# Altium project Sense2goL_V1.2.PrjPcb
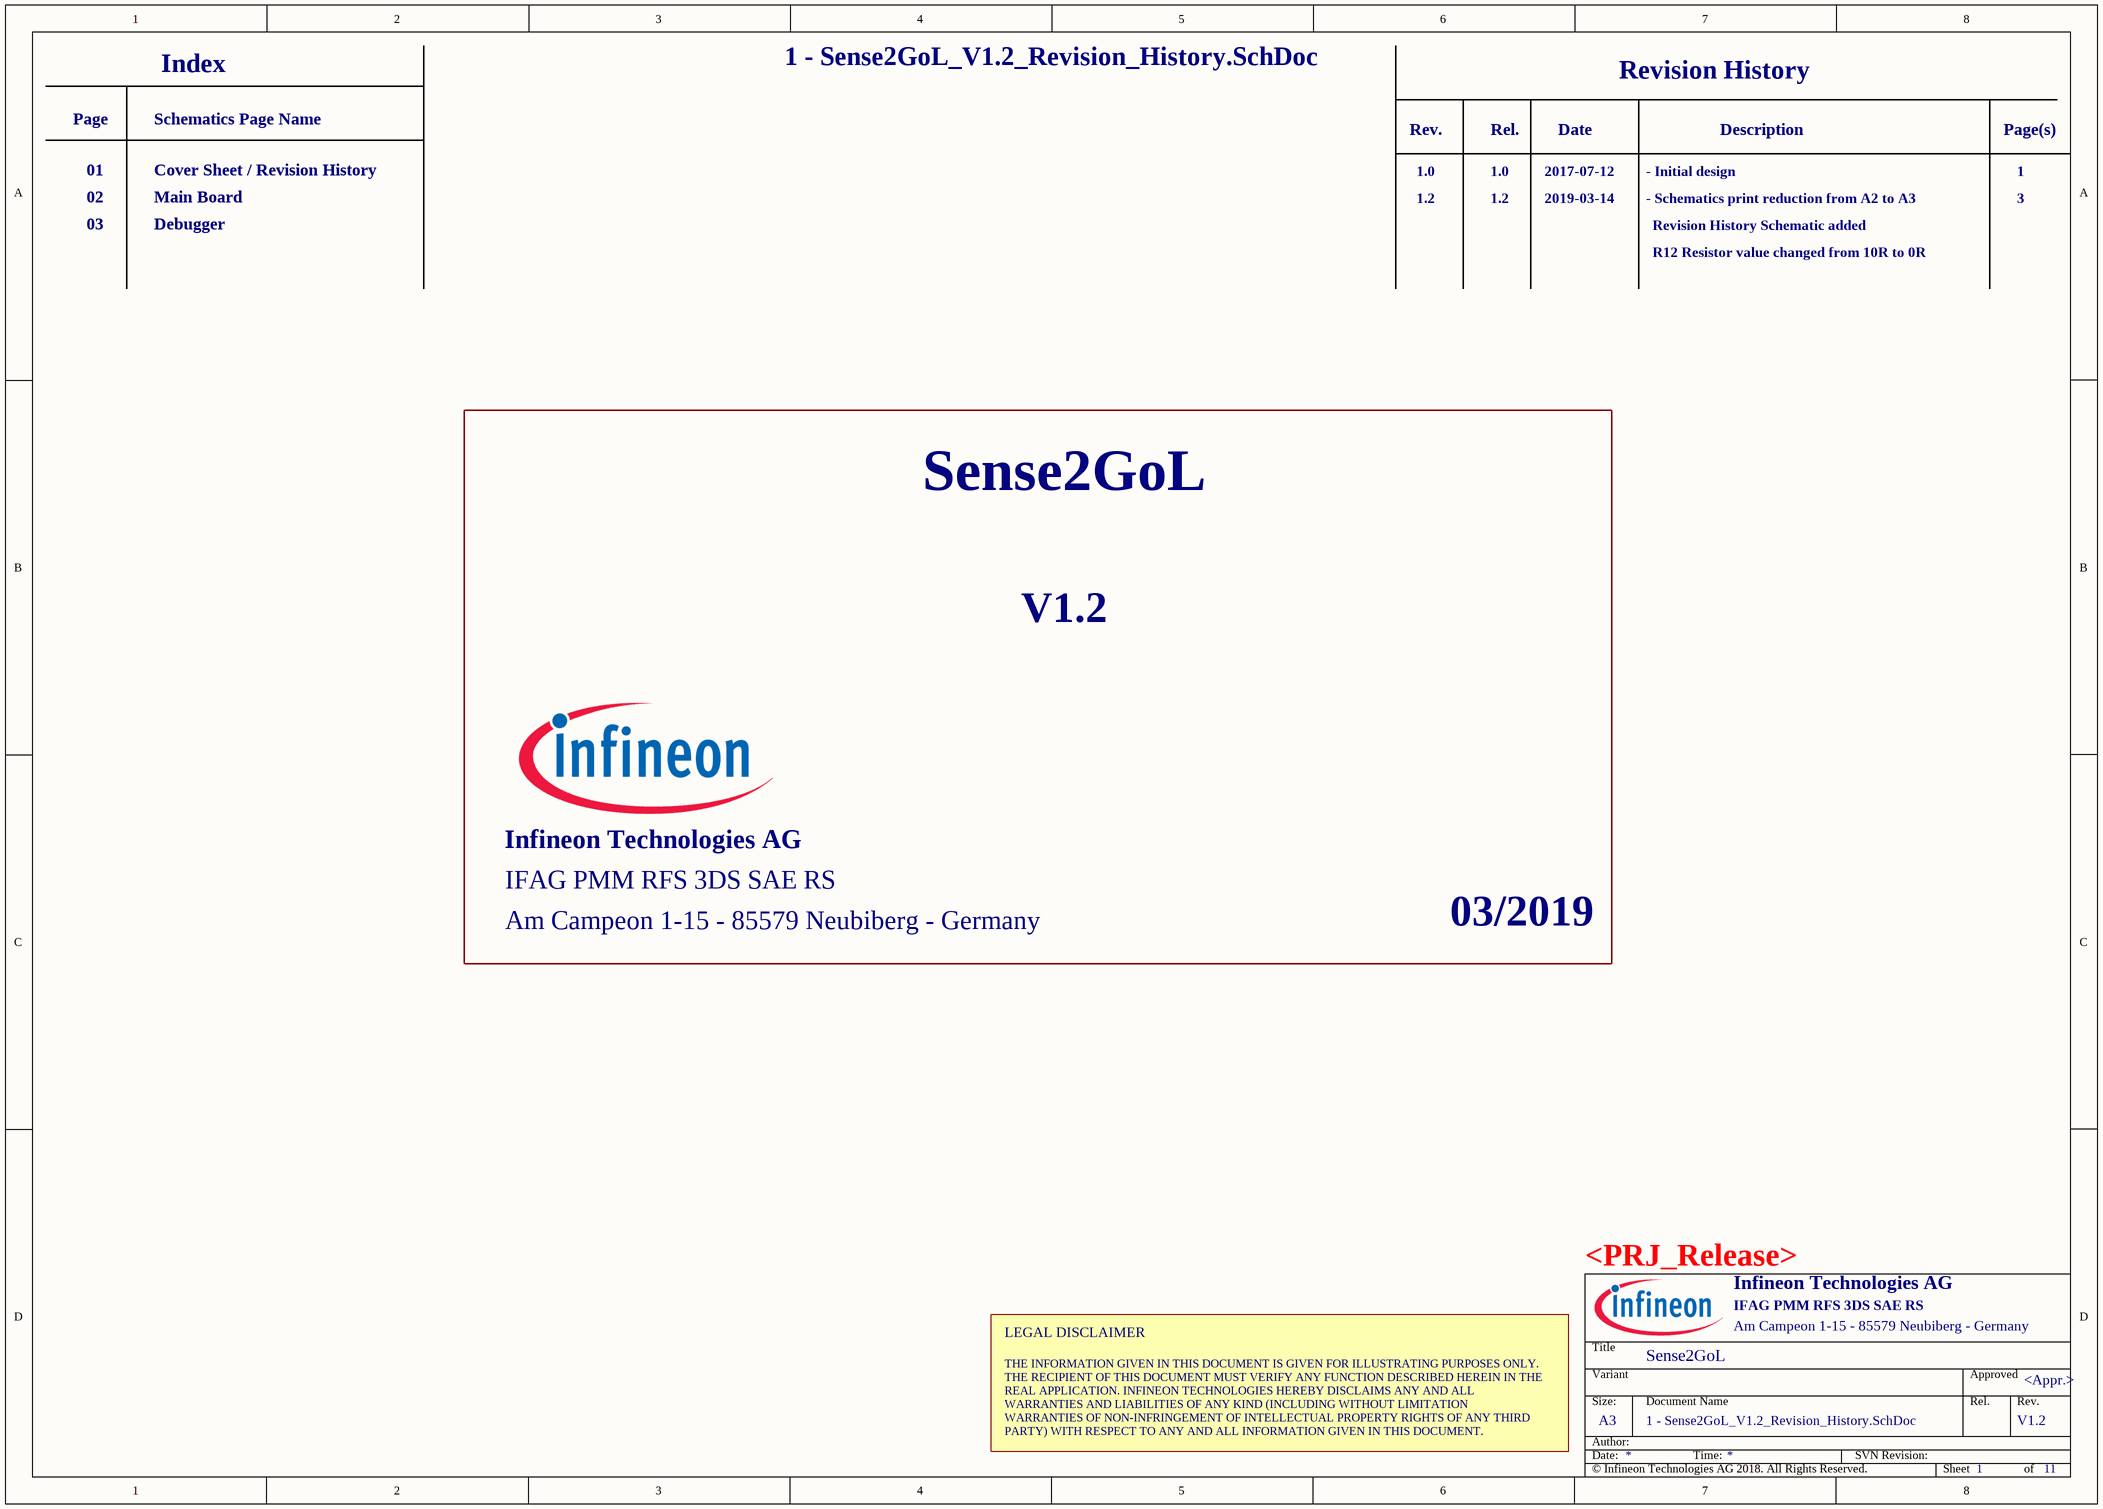
[diagram p0: 1 - Sense2GoL_V1.2_Revision_History.SchDoc]
PRJ_Address1: IFAG PMM RFS 3DS SAE RS; PRJ_Address2: Am Campeon 1-15 - 85579 Neubiberg - Germany; PRJ_ConfidentialStatus: <PRJ_Release>; PRJ_Copyright: © Infineon Technologies AG 2018. All Rights Reserved.; PRJ_Organization: Infineon Technologies AG; PRJ_Revision: V1.2; PRJ_SCH_Revision: V1.2; PRJ_Title: Sense2GoL; PRJ_Year: 03/2019
3 sheets, 114 parts. Net scope: global (net labels, ports and power ports of the same name join across sheets).
Board file: Sense2goL_V1.2.PcbDoc
Sheets:
  1 - Sense2GoL_V1.2_Revision_History.SchDoc
  2 - Sense2GoL_V1.2_Main_Board.SchDoc
  3 - Sense2GoL_V1.2_Debugger.SchDoc

## Sheet 1 - Sense2GoL_V1.2_Revision_History.SchDoc: <Project Name>
size A3; ApprovedBy: <Appr.>; Author: <Author>; CompanyName: Infineon Technologies AG; Engineer: <Rel.>; Organization: Infineon Technologies AG; Address1: IFAG PMM RFS MM AE; Address2: Am Campeon 1-12  -  85579 Neubiberg  -  Germany; Address3: 85579 Neubiberg; Address4: Germany; DocumentNumber: 1; Revision: <Rev.>; SheetNumber: 1; SheetTotal: 11; Release: RC00; PageSetup: Record=PageOptions|CenterHorizontal=True|CenterVertical=True|PrintScale=1.01|XCorrection=1.00|YCorrection=1.00|PrintKind=0|BorderSize=5000000|LeftOffset=0|BottomOffset=0|Orientation=2|PaperLength=1000|PaperWidth=1000|Scale=100|PaperSource=7|PrintQuality=-4|MediaType=1|DitherType=10|PaperKind=A3|PrintScaleMode=1; Doc_ConfidentialStatus: <Confidential>; Doc_Preliminary: <Doc_Preliminary>

### Notes on the sheet
- Index
- Revision History
- Page
- 01
- Cover Sheet / Revision History
- Schematics Page Name
- Rev.
- 1.0
- Rel.
- 2017-07-12
- Date
- - Initial design
- Description
- Page(s)
- 1
- 03
- 02
- Debugger
- Main Board
- 1.2
- 2019-03-14
- - Schematics print reduction from A2 to A3
- Revision History Schematic added
- 3
- R12 Resistor value changed from 10R to 0R
- LEGAL DISCLAIMER
- THE INFORMATION GIVEN IN THIS DOCUMENT IS GIVEN FOR ILLUSTRATING PURPOSES ONLY.
  THE RECIPIENT OF THIS DOCUMENT MUST VERIFY ANY FUNCTION DESCRIBED HEREIN IN THE
  REAL APPLICATION. INFINEON TECHNOLOGIES HEREBY DISCLAIMS ANY AND ALL
  WARRANTIES AND LIABILITIES OF ANY KIND (INCLUDING WITHOUT LIMITATION
  WARRANTIES OF NON-INFRINGEMENT OF INTELLECTUAL PROPERTY RIGHTS OF ANY THIRD
  PARTY) WITH RESPECT TO ANY AND ALL INFORMATION GIVEN IN THIS DOCUMENT.
- Title
- Variant
- Approved
- Date:
- Author:
- Size:
- A3
- Document Name
- Time:
- SVN Revision:
- Sheet
- of

## Sheet 2 - Sense2GoL_V1.2_Main_Board.SchDoc
size A3; Doc_ConfidentialStatus: <Doc_ConfidentialStatus>; Doc_Preliminary: <Doc_Preliminary>; Release: <Rel.>; Copyright: © Infineon Technologies AG 2014. All Rights Reserved.; DVS_Title: <DVS_Title>; DVS_Author: <DVS_Author>; DVS_ApprovedBy: <DVS_Appr>; DVS_Revision: <DVS_Rev.>; DVS_Release: <DVS_Rel.>; DVS_Configuration: <DVS_Configuration>; PageSetup: Record=PageOptions|CenterHorizontal=True|CenterVertical=True|PrintScale=1.01|XCorrection=1.00|YCorrection=1.00|PrintKind=0|BorderSize=5000000|LeftOffset=0|BottomOffset=0|Orientation=2|PaperLength=1000|PaperWidth=1000|Scale=100|PaperSource=7|PrintQuality=-4|MediaType=1|DitherType=10|PaperKind=A3|PrintScaleMode=1
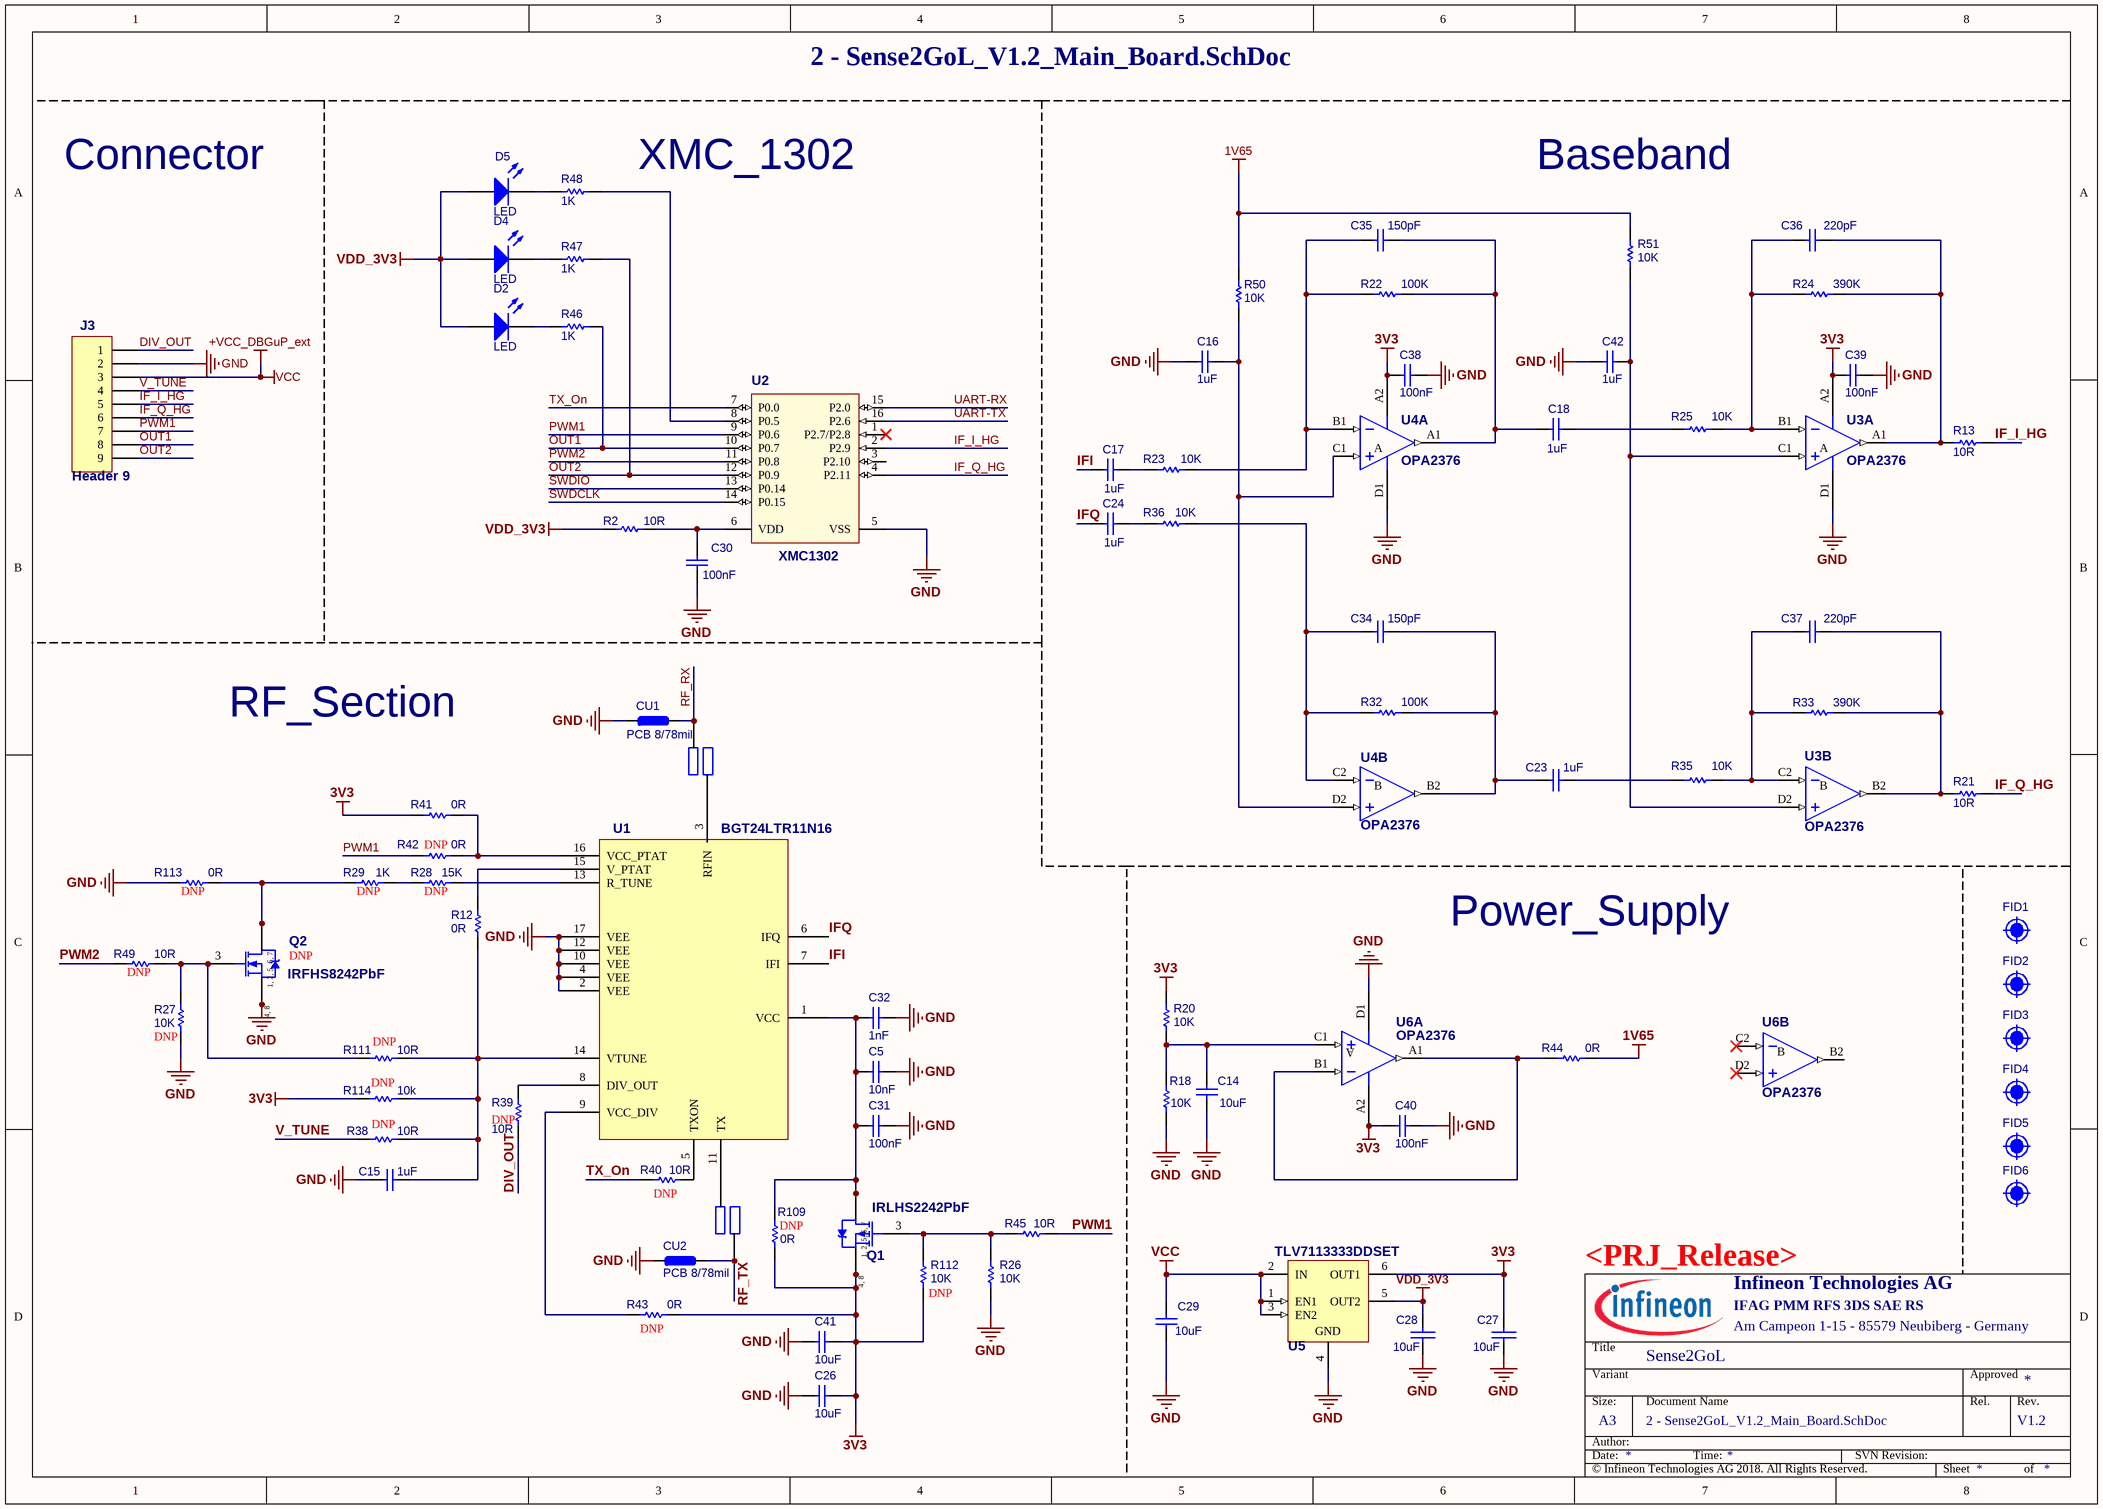
[diagram p1: 2 - Sense2GoL_V1.2_Main_Board.SchDoc]

### Parts
C5  value 10nF  [C_0201]  (hidden comment: Cap)
C14  value 10uF  [0402_DURAC]  (hidden comment: Cap)
C15  value 1uF  [0402_DURAC]  (hidden comment: Cap)
C16  value 1uF  [0402_DURAC]  (hidden comment: Cap)
C17  value 1uF  [0402_DURAC]  (hidden comment: 1µF)
C18  value 1uF  [0402_DURAC]  (hidden comment: Cap)
C23  value 1uF  [0402_DURAC]  (hidden comment: Cap)
C24  value 1uF  [0402_DURAC]  (hidden comment: Cap)
C26  value 10uF  [0402_DURAC]  (hidden comment: Cap)
C27  value 10uF  [0402_DURAC]  (hidden comment: CAP-10uF-10V-20%-0603)
C28  value 10uF  [0402_DURAC]  (hidden comment: CAP-10uF-10V-20%-0603)
C29  value 10uF  [0402_DURAC]  (hidden comment: CAP-1uF-25V-10%-0402)
C30  value 100nF  [C_0201]  (hidden comment: Cap)
C31  value 100nF  [C_0201]  (hidden comment: Cap)
C32  value 1nF  [C_0201]  (hidden comment: Cap)
C34  value 150pF  [C_0201]  (hidden comment: Cap)
C35  value 150pF  [C_0201]  (hidden comment: Cap)
C36  value 220pF  [C_0201]  (hidden comment: Cap)
C37  value 220pF  [C_0201]  (hidden comment: Cap)
C38  value 100nF  [C_0201]  (hidden comment: Cap)
C39  value 100nF  [C_0201]  (hidden comment: Cap)
C40  value 100nF  [C_0201]  (hidden comment: Cap)
C41  value 10uF  [0402_DURAC]  (hidden comment: Cap)
C42  value 1uF  [0402_DURAC]  (hidden comment: Cap)
CU1  PCB 8/78mil  [24GHZ_TRACE_8_78]  (net tie, no BOM)
CU2  PCB 8/78mil  [24GHZ_TRACE_8_78]  (net tie, no BOM)
D2  LED  [LED_0201]
D4  LED  [LED_0201]
D5  LED  [LED_0201]
DC1  HF-Bandbpass  [DC_BLOCK_24GHZ]  (value not drawn)  (no BOM)
DC2  HF-Bandbpass  [DC_BLOCK_24GHZ]  (value not drawn)  (no BOM)
FID1  Fiducial  [FID_1.1mm]  (value not drawn)
FID2  Fiducial  [FID_1.1mm]  (value not drawn)
FID3  Fiducial  [FID_1.1mm]  (value not drawn)
FID4  Fiducial  [FID_1.1mm]  (value not drawn)
FID5  Fiducial  [FID_1.1mm]  (value not drawn)
FID6  Fiducial  [FID_1.1mm]  (value not drawn)
J3  Header 9  [CONN_9_90DEG_TH]
Q1  IRLHS2242PbF  [IRLSH2242]
Q2  value IRFHS8242PbF  [IRLSH2242]  (hidden comment: DNP)
R2  value 10R  [R_0201]  (hidden comment: Res1)
R12  value 0R  [R_0201]  (hidden comment: Res1)
R13  value 10R  [R_0201]  (hidden comment: Res1)
R18  value 10K  [R_0201]  (hidden comment: Res1)
R20  value 10K  [R_0201]  (hidden comment: Res1)
R21  value 10R  [R_0201]  (hidden comment: Res1)
R22  value 100K  [R_0201]  (hidden comment: Res1)
R23  value 10K  [R_0201]  (hidden comment: Res1)
R24  value 390K  [R_0201]  (hidden comment: Res1)
R25  value 10K  [R_0201]  (hidden comment: Res1)
R26  value 10K  [R_0201]  (hidden comment: Res1)
R27  value 10K  [R_0201]  (hidden comment: DNP)
R28  value 15K  [R_0201]  (hidden comment: DNP)
R29  value 1K  [R_0201]  (hidden comment: DNP)
R32  value 100K  [R_0201]  (hidden comment: Res1)
R33  value 390K  [R_0201]  (hidden comment: Res1)
R35  value 10K  [R_0201]  (hidden comment: Res1)
R36  value 10K  [R_0201]  (hidden comment: Res1)
R38  value 10R  [R_0201]  (hidden comment: DNP)
R39  value 10R  [R_0201]  (hidden comment: DNP)
R40  value 10R  [R_0201]  (hidden comment: DNP)
R41  value 0R  [R_0201]  (hidden comment: Res1)
R42  value 0R  [R_0201]  (hidden comment: DNP)
R43  value 0R  [R_0201]  (hidden comment: DNP)
R44  value 0R  [R_0201]  (hidden comment: Res1)
R45  value 10R  [R_0201]  (hidden comment: Res1)
R46  value 1K  [R_0201]  (hidden comment: Res1)
R47  value 1K  [R_0201]  (hidden comment: Res1)
R48  value 1K  [R_0201]  (hidden comment: Res1)
R49  value 10R  [R_0201]  (hidden comment: DNP)
R50  value 10K  [R_0201]  (hidden comment: Res1)
R51  value 10K  [R_0201]  (hidden comment: Res1)
R109  value 0R  [R_0201]  (hidden comment: DNP)
R111  value 10R  [R_0201]  (hidden comment: DNP)
R112  value 10K  [R_0201]  (hidden comment: DNP)
R113  value 0R  [R_0201]  (hidden comment: DNP)
R114  value 10k  [R_0201]  (hidden comment: DNP)
U1  BGT24LTR11N16  [TSNP-16-9]
U2  XMC1302  [inf-pg-tssop-16-8_n]
U3  OPA2376  [OPA2376_DSBGA]  (parts A,B of 2)
U4  OPA2376  [OPA2376_DSBGA]  (parts A,B of 2)
U5  TLV7113333DDSET  [TLV7113333]
U6  OPA2376  [OPA2376_DSBGA]  (parts A,B of 2)

### Nets
1V65: R44.2 R50.1 R51.1
3V3: C26.2 C27.1 C38.1 C39.1 C40.1 C41.2 Q1.4(S) Q1.8(S) R20.2 R41.1 R43.2 R109.1 R112.1 R114.1 U3.A2(V+) U4.A2(V+) U5.6(OUT1) U6.A2(V+)
+VCC_DBGuP_ext: C29.1 J3.3 U5.1(EN1) U5.2(IN) U5.3(EN2)  [also labelled VCC]
GND: C5.2 C14.2 C15.1 C16.1 C26.1 C27.2 C28.2 C29.2 C30.2 C31.2 C32.2 C38.2 C39.2 C40.2 C41.1 C42.1 CU1.2 CU2.2 J3.2 Q2.4(S) Q2.8(S) R18.1 R26.1 R27.1 R113.1 U1.2(VEE) U1.4(VEE) U1.10(VEE) U1.12(VEE) U1.17(VEE) U2.5(VSS) U3.D1(V-) U4.D1(V-) U5.4(GND) U6.D1(V-)
VDD_3V3: C28.1 D2.1(A) D4.1(A) D5.1(A) R2.1 U5.5(OUT2)
DIV_OUT: J3.1 R39.1
IF_I_HG: J3.5 R13.2 U2.2(P2.9)
IF_Q_HG: J3.6 R21.2 U2.4(P2.11)
IFI: C17.1 U1.7(IFI)
IFQ: C24.1 U1.6(IFQ)
OUT1: J3.8 R46.2 U2.10(P0.7)
OUT2: J3.9 R47.2 U2.12(P0.9)
PWM1: J3.7 R42.1 R45.2 U2.9(P0.6)
PWM2: R49.1 U2.11(P0.8)
RF_RX: CU1.1 DC2.1
RF_TX: CU2.1 DC1.1
SWDCLK: U2.14(P0.15)
SWDIO: U2.13(P0.14)
TX_On: R40.1 U2.7(P0.0)
UART-RX: U2.15(P2.0)
UART-TX: U2.16(P2.6)
V_TUNE: J3.4 R38.1
NetC5_1: C5.1 C31.1 C32.1 Q1.1(D) Q1.2(D) Q1.5(D) Q1.6(D) Q1.7(D) R109.2 U1.1(VCC)
NetC14_1: C14.1 R18.2 R20.1 U6.C1(+INA)
NetC15_2: C15.2 R12.1 R38.2 R111.2 R114.2 U1.14(VTUNE)
NetC16_2: C16.2 R50.2 U4.C1(+INA) U4.D2(IN+)
NetC17_2: C17.2 R23.1
NetC18_1: C18.1 C35.2 R22.2 U4.A1(OUT_A)
NetC18_2: C18.2 R25.1
NetC23_1: C23.1 C34.2 R32.2 U4.B2(OUT)
NetC23_2: C23.2 R35.1
NetC24_2: C24.2 R36.1
NetC30_1: C30.1 R2.2 U2.6(VDD)
NetC34_1: C34.1 R32.1 R36.2 U4.C2(IN-)
NetC35_1: C35.1 R22.1 R23.2 U4.B1(-INA)
NetC36_1: C36.1 R24.1 R25.2 U3.B1(-INA)
NetC36_2: C36.2 R13.1 R24.2 U3.A1(OUT_A)
NetC37_1: C37.1 R33.1 R35.2 U3.C2(IN-)
NetC37_2: C37.2 R21.1 R33.2 U3.B2(OUT)
NetC42_2: C42.2 R51.2 U3.C1(+INA) U3.D2(IN+)
NetD2_2: D2.2(K) R46.1
NetD4_2: D4.2(K) R47.1
NetD5_2: D5.2(K) R48.1
NetDC1_2: DC1.2 U1.11(TX)
NetDC2_2: DC2.2 U1.3(RFIN)
NetQ1_3: Q1.3(G) R26.2 R45.1 R112.2
NetQ2_1: Q2.1(D) Q2.2(D) Q2.5(D) Q2.6(D) Q2.7(D) R29.1 R113.2
NetQ2_3: Q2.3(G) R27.2 R49.2 R111.1
NetR12_2: R12.2 U1.15(V_PTAT)
NetR28_1: R28.1 R29.2
NetR28_2: R28.2 U1.13(R_TUNE)
NetR39_2: R39.2 U1.8(DIV_OUT)
NetR40_2: R40.2 U1.5(TXON)
NetR41_2: R41.2 R42.2 U1.16(VCC_PTAT)
NetR43_1: R43.1 U1.9(VCC_DIV)
NetR44_1: R44.1 U6.A1(OUT_A) U6.B1(-INA)
NetR48_2: R48.2 U2.8(P0.5)

Not connected (* = marked no-connect by the designer): U2 1(P2.7/P2.8)* 3(P2.10); U6 B2(OUT) C2(IN-)* D2(IN+)*

### Notes on the sheet
- Connector
- (near R48) XMC_1302
- Baseband
- RF_Section
- (near R42) DNP
- (near R113) DNP
- (near R29) DNP
- (near R28) DNP
- (near R49) DNP
- (near Q2) DNP
- Power_Supply
- (near R27) DNP
- (near R111) DNP
- DNP
- (near R38) DNP
- (near R39) DNP
- (near R40) DNP
- (near R109) DNP
- (near R43) DNP
- (near R112) DNP
- Title
- Variant
- Approved
- Date:
- Author:
- Size:
- A3
- Document Name
- Time:
- SVN Revision:
- Rel.
- Rev.
- Sheet
- of
- (in symbol IRLHS2242PbF) 1, 2, 5, 6, 7; 4, 8
- (in symbol IRLHS8242PbF) 1, 2, 5, 6, 7; 4, 8
- (in symbol OPA2376, part A) A
- (in symbol OPA2376, part B) B

### Library data of the parts
C5 C14-C18 C23 C24 C26 C30-C32 C34-C42 = Cap: Capacitor; Published: 8-Jun-2000; LatestRevisionDate: 17-Jul-2002; LatestRevisionNote: Re-released for DXP Platform.; PackageReference: RAD-0.3; Publisher: Altium Limited
  C17 C18 C23 C24 C34-C37: PackageDescription: Radial Cap, Thru-Hole; 2 Leads; 0.3 in Pin Spacing
C27 C28 = CAP: Ceramic Capacitor X5R/X7R >= 10V; Manufacturer: TDK; Bestellnummer: 2309028; Dielectric: X5R; Footprint: 0603; Link: http://de.farnell.com/tdk/c1608x5r1a106m080ac/kondensator-mlcc-x5r-10uf-10v/dp/2309028; Price: 0.44
C29 = Cap: Capacitor; Manufacturer: TDK; Bestellnummer: 2346884RL; Dielectric: X5R; Link: http://de.farnell.com/tdk/c1005x5r1e105k050bc/kondensator-mlcc-x5r-1uf-25v-0402/dp/2346884RL?ost=2346884RL; Footprint: 0402; Price: 0.07
CU1 CU2 = 24G_Trace: Preis: 0.0; FootprintBOM: -
D2 D4 D5 = LED: Typical INFRARED GaAs LED; Published: 8-Jun-2000; LatestRevisionDate: 08-Jul-2005; LatestRevisionNote: Mech Layer 1 removed.; PackageReference: LED-0; Publisher: Altium Limited
DC1 DC2 = HF-Bandbpass: Preis: 0.00; FootprintBOM: -
FID1-FID6 = FID: FootprintBOM: Fiducal 1.1mm; Notes: Fiducial
J3 = Header 9: Header, 9-Pin; LatestRevisionDate: 17-Jul-2002; LatestRevisionNote: Re-released for DXP Platform.; Publisher: Altium Limited
Q1 = IRLHS2242PbF: Note: Pin 2 is electrically connected to pin 4.; Published: 8-Jun-2000; LatestRevisionDate: 17-Jul-2002; LatestRevisionNote: Re-released for DXP Platform.; DatasheetVersion: May-1998; PackageReference: TO-251AA; Publisher: Altium Limited; PackageDescription: TO, Thru-Hole, Vertical, Heatsink Mounted; 3 In-Line Leads; Pitch 2.28 mm; ComponentLink1Description: Manufacturer Link; ComponentLink1URL: http://www.irf.com/; ComponentLink2Description: Datasheet; ComponentLink2URL: http://www.irf.com/product-info/datasheets/data/irlr120n.pdf
Q2 = IRLHS8242PbF: IRFHS8242PbF; Note: Pin 2 is electrically connected to pin 4.; Published: 8-Jun-2000; LatestRevisionDate: 17-Jul-2002; LatestRevisionNote: Re-released for DXP Platform.; DatasheetVersion: May-1998; PackageReference: TO-251AA; Publisher: Altium Limited; PackageDescription: TO, Thru-Hole, Vertical, Heatsink Mounted; 3 In-Line Leads; Pitch 2.28 mm; ComponentLink1Description: Manufacturer Link; ComponentLink1URL: http://www.irf.com/; ComponentLink2Description: Datasheet; ComponentLink2URL: http://www.irf.com/product-info/datasheets/data/irlr120n.pdf
R2 R12 R13 R18 R20-R29 R32 R33 R35 R36 R38-R51 R109 R111-R114 = Res1: Resistor; Published: 8-Jun-2000; LatestRevisionDate: 17-Jul-2002; LatestRevisionNote: Re-released for DXP Platform.; PackageReference: AXIAL-0.3; Publisher: Altium Limited
  R22-R25 R32 R33 R35 R36: PackageDescription: Axial Device, Thru-Hole; 2 Leads; 0.3 in Pin Spacing
U2 = XMC1302-T016F-0016 AA: code_DK: XMC1302T016X0032ABXUMA1CT-ND
U5 = TLV7113333DDSET: Dual Output High PSRR LDO, 200 mA, Fixed 3.3 V Output, 2 to 5.5 V Input, 6-pin WSON (DSE), -40 to 125 degC, Green (RoHS & no Sb/Br); Manufacturer: Texas Instruments; Fixed Output Options(V): 3.3; Iout(Max)(A): 0.2; Iq(Typ)(mA): 0.03; SubFamily: Dual Channel LDO; Vdo(Typ)(mV): 150; Vin(Max)(V): 5.5; Vin(Min)(V): 2; DatasheetVersion: SBVS142A; PackageVersion: 4207810/A; PackageReference: DSE6; PackageDescription: 6-Pin Plastic Small Outline, Body 1.5 x 1.5 mm, Pitch 0.5 mm; Supplier 1: Digi-Key; Supplier Part Number 1: 296-28766-2-ND; Supplier 2: Digi-Key; Supplier Part Number 2: 296-28766-1-ND; Supplier 3: Digi-Key; Supplier Part Number 3: 296-28766-6-ND; Supplier 4: Mouser; Supplier Part Number 4: 595-TLV7113333DDSET; Eco-Plan: Green (RoHS & no Sb/Br); Mounting Technology: Surface Mount; PartNumber: TLV7113333DDSET; ComponentLink1Description: Manufacturer URL; ComponentLink1URL: http://www.ti.com/; ComponentLink2Description: Datasheet; ComponentLink2URL: http://www.ti.com/general/docs/lit/getliterature.tsp?genericPartNumber=TLV7113333D&fileType=pdf; ComponentLink3Description: Package Specification; ComponentLink3URL: http://www.ti.com/litv/pdf/mpds287
U3 U4 U6 = OPA2376: Published: 8-Jun-2000; LatestRevisionDate: 17-Jul-2002; LatestRevisionNote: Re-released for DXP Platform.; DatasheetVersion: 1996~1997; PackageVersion: revC; PackageReference: ZZ030; Publisher: Altium Limited; PackageDescription: Oval Flange Mount; 8 Leads; Pin Circle Dia. 12.7 mm; Lead Dia. 1.07 mm (max); ComponentLink1Description: Manufacturer Link; ComponentLink1URL: http://www.ti.com/; ComponentLink2Description: Datasheet; ComponentLink2URL: http://www-s.ti.com/sc/ds/opa2544.pdf

## Sheet 3 - Sense2GoL_V1.2_Debugger.SchDoc
size A3; Doc_ConfidentialStatus: <Doc_ConfidentialStatus>; Doc_Preliminary: <Doc_Preliminary>; Release: <Rel.>; Copyright: © Infineon Technologies AG 2014. All Rights Reserved.; DVS_Title: <DVS_Title>; DVS_Author: <DVS_Author>; DVS_ApprovedBy: <DVS_Appr>; DVS_Revision: <DVS_Rev.>; DVS_Release: <DVS_Rel.>; DVS_Configuration: <DVS_Configuration>; PageSetup: Record=PageOptions|CenterHorizontal=True|CenterVertical=True|PrintScale=1.01|XCorrection=1.00|YCorrection=1.00|PrintKind=0|BorderSize=5000000|LeftOffset=0|BottomOffset=0|Orientation=2|PaperLength=1000|PaperWidth=1000|Scale=100|PaperSource=7|PrintQuality=-4|MediaType=1|DitherType=10|PaperKind=A3|PrintScaleMode=1
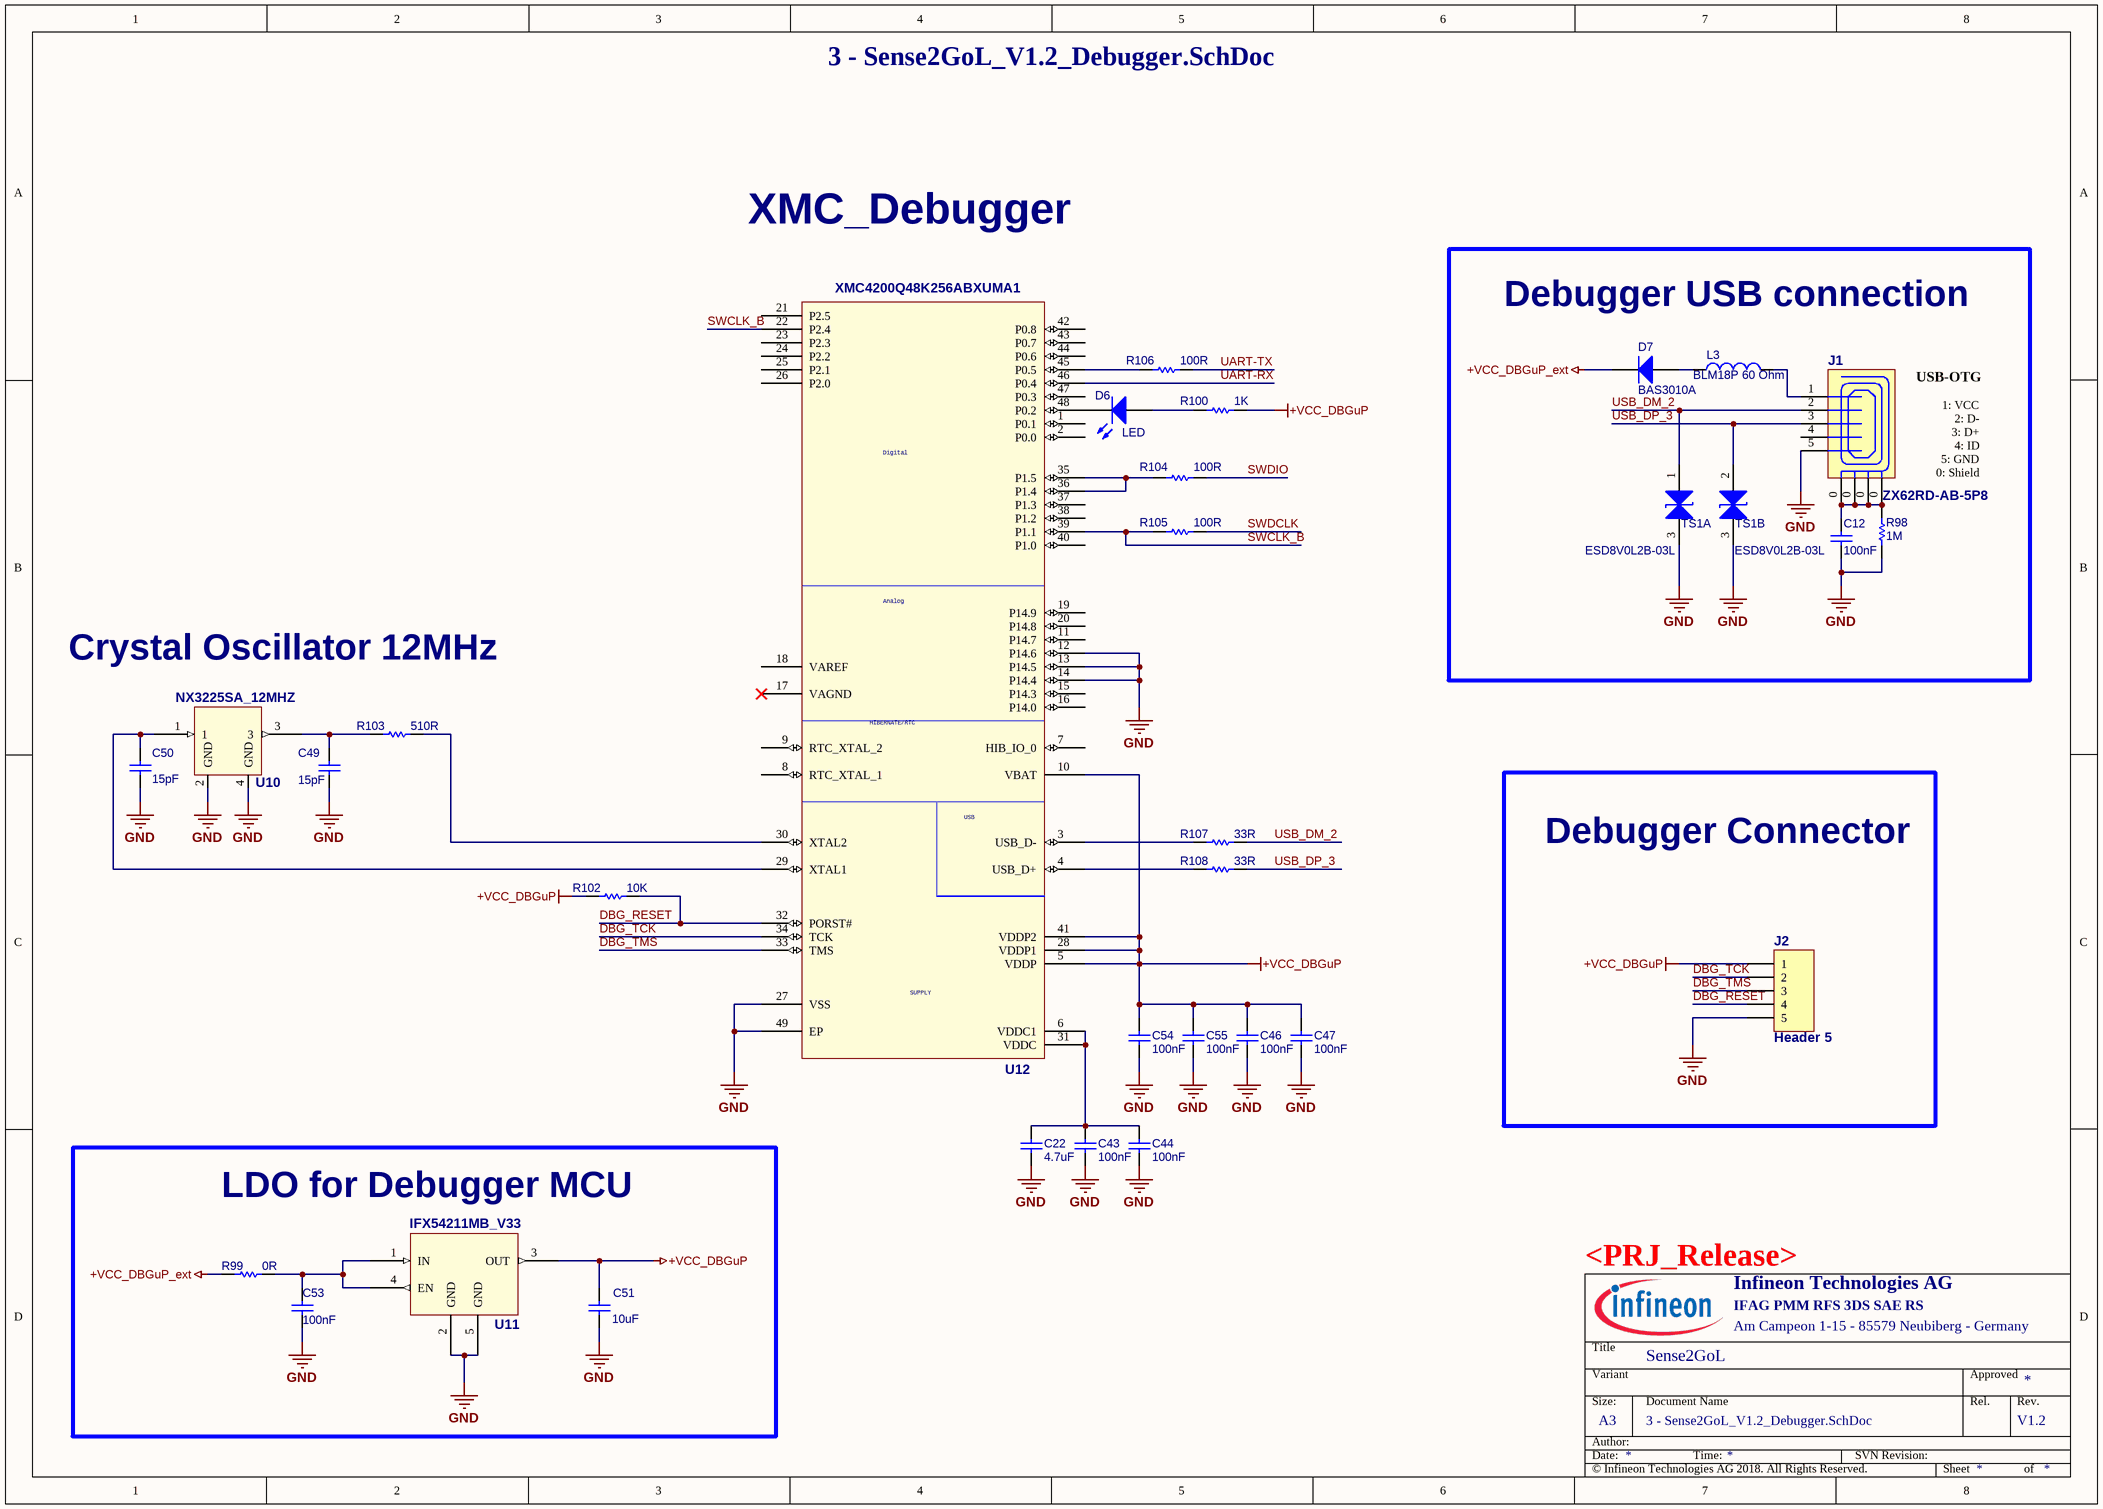
[diagram p2: 3 - Sense2GoL_V1.2_Debugger.SchDoc]

### Parts
C12  value 100nF  [0402_DURAC]  (hidden comment: Cap)
C22  value 4.7uF  [0402_DURAC]  (hidden comment: Cap)
C43  value 100nF  [0402_DURAC]  (hidden comment: Cap)
C44  value 100nF  [0402_DURAC]  (hidden comment: Cap)
C46  value 100nF  [0402_DURAC]  (hidden comment: Cap)
C47  value 100nF  [0402_DURAC]  (hidden comment: Cap)
C49  value 15pF  [0402_DURAC]  (hidden comment: Cap)
C50  value 15pF  [0402_DURAC]  (hidden comment: Cap)
C51  value 10uF  [0402_DURAC]  (hidden comment: Cap)
C53  value 100nF  [0402_DURAC]  (hidden comment: Cap)
C54  value 100nF  [0402_DURAC]  (hidden comment: Cap)
C55  value 100nF  [0402_DURAC]  (hidden comment: Cap)
D6  LED  [LED_0201]
D7  BAS3010A  [SOD323]
J1  ZX62RD-AB-5P8  [MICRO_AB_ZX62]
J2  Header 5  [CON_5PIN_254P]
L3  BLM18P 60 Ohm  [L_0603]
R98  value 1M  [0402_R]  (hidden comment: Res1)
R99  value 0R  [0402_R]  (hidden comment: Res1)
R100  value 1K  [R_0201]  (hidden comment: Res1)
R102  value 10K  [0402_R]  (hidden comment: Res1)
R103  value 510R  [0402_R]  (hidden comment: Res1)
R104  value 100R  [0402_R]  (hidden comment: Res1)
R105  value 100R  [0402_R]  (hidden comment: Res1)
R106  value 100R  [0402_R]  (hidden comment: Res1)
R107  value 33R  [0402_R]  (hidden comment: Res1)
R108  value 33R  [0402_R]  (hidden comment: Res1)
TS1  ESD8V0L2B-03L  [ESD8VOL2B]  (parts A,B of 2)
U10  NX3225SA_12MHZ  [NX3225SA]
U11  IFX54211MB_V33  [inf-pg-sct595v]
U12  XMC4200Q48K256ABXUMA1  [inf-pg-vqfn-48-_-5200x5200tp_n]

### Blocks framed on the sheet
Debugger USB connection: C12 D7 J1 L3 R98 TS1
Debugger Connector: J2
LDO for Debugger MCU: C51 C53 R99 U11

### Nets
+VCC_DBGuP: C46.2 C47.2 C51.2 C54.2 C55.2 J2.1 R100.1 R102.1 U11.3(OUT) U12.5(VDDP) U12.10(VBAT) U12.28(VDDP1) U12.41(VDDP2)
+VCC_DBGuP_ext: D7.2(K) R99.2
GND: C12.2 C22.2 C43.1 C44.1 C46.1 C47.1 C49.2 C50.2 C51.1 C53.2 C54.1 C55.1 J1.5(GND) J2.5 R98.1 TS1.3 U10.2(GND) U10.4(GND) U11.2(GND) U11.5(GND) U12.12(P14.6) U12.13(P14.5) U12.14(P14.4) U12.27(VSS) U12.49(EP)
DBG_RESET: J2.4 R102.2 U12.32(PORST#)
DBG_TCK: J2.2 U12.34(TCK)
DBG_TMS: J2.3 U12.33(TMS)
SWCLK_B: R105.1 U12.22(P2.4) U12.39(P1.1)
SWDCLK: R105.2
SWDIO: R104.2
UART-RX: U12.46(P0.4)
UART-TX: R106.2
USB_DM_2: J1.2(D-) R107.2 TS1.1
USB_DP_3: J1.3(D+) R108.2 TS1.2
NetC12_1: C12.1 J1.0(Shield) R98.2
NetC22_1: C22.1 C43.2 C44.2 U12.6(VDDC1) U12.31(VDDC)
NetC49_1: C49.1 R103.1 U10.3
NetC50_1: C50.1 U10.1 U12.29(XTAL1)
NetC53_1: C53.1 R99.1 U11.1(IN) U11.4(EN)
NetD6_1: D6.1(A) R100.2
NetD6_2: D6.2(K) U12.48(P0.2)
NetD7_1: D7.1(A) L3.1
NetJ1_1: J1.1(VCC) L3.2
NetR103_2: R103.2 U12.30(XTAL2)
NetR104_1: R104.1 U12.35(P1.5) U12.36(P1.4)
NetR106_1: R106.1 U12.45(P0.5)
NetR107_1: R107.1 U12.3(USB_D-)
NetR108_1: R108.1 U12.4(USB_D+)

Not connected (* = marked no-connect by the designer): J1 4(ID); U12 1(P0.1) 2(P0.0) 7(HIB_IO_0) 8(RTC_XTAL_1) 9(RTC_XTAL_2) 11(P14.7) 15(P14.3) 16(P14.0) 17(VAGND)* 18(VAREF) 19(P14.9) 20(P14.8) 21(P2.5) 23(P2.3) 24(P2.2) 25(P2.1) 26(P2.0) 37(P1.3) 38(P1.2) 40(P1.0) 42(P0.8) 43(P0.7) 44(P0.6) 47(P0.3)

### Notes on the sheet
- XMC_Debugger
- Crystal Oscillator 12MHz
- Title
- Variant
- Approved
- Date:
- Author:
- Size:
- A3
- Document Name
- Time:
- SVN Revision:
- Rel.
- Rev.
- Sheet
- of
- (in symbol USB Micro AB) USB-OTG; 1: VCC; 2: D-; 3: D+; 4: ID; 5: GND; 0: Shield
- (in symbol XMC4200_VQFN48) Digital; Analog; HIBERNATE/RTC; USB; SUPPLY

### Library data of the parts
C12 C22 C43 C44 C46 C47 C49-C51 C53-C55 = Cap: Capacitor; Published: 8-Jun-2000; LatestRevisionDate: 17-Jul-2002; LatestRevisionNote: Re-released for DXP Platform.; PackageReference: RAD-0.3; Publisher: Altium Limited
D6 = LED: Typical INFRARED GaAs LED; Published: 8-Jun-2000; LatestRevisionDate: 08-Jul-2005; LatestRevisionNote: Mech Layer 1 removed.; PackageReference: LED-0; Publisher: Altium Limited
D7 = Diode: Default Diode; Published: 8-Jun-2000; LatestRevisionDate: 17-Jul-2002; LatestRevisionNote: Re-released for DXP Platform.; PackageDocument: Sep-1996; PackageReference: SMC; Publisher: Altium Limited; Code_JEDEC: DO-214-AB
J1 = USB Micro AB: Hersteller: Hirose; Preis: 1.59; FootprintBOM: SMD; Kleinmengendistributor: Digi-Key; KleinmengendistributorBestellnummer: H11611CT-ND
J2 = Header 5: Header, 5-Pin; LatestRevisionDate: 17-Jul-2002; LatestRevisionNote: Re-released for DXP Platform.; Publisher: Altium Limited
L3 = Ferrite Bead
R98-R100 R102-R108 = Res1: Resistor; Published: 8-Jun-2000; LatestRevisionDate: 17-Jul-2002; LatestRevisionNote: Re-released for DXP Platform.; PackageReference: AXIAL-0.3; Publisher: Altium Limited
TS1 = Diode dual: TVS Diode dual; Hersteller: Infineon; Preis: 0.56; FootprintBOM: TSLP-3-1; Kleinmengendistributor: Digi-Key; KleinmengendistributorBestellnummer: ESD8V0L2B-03LE6327INCT-ND
U10 = NX3225SA_12MHZ: NX3225SA-12.000M-STD-CRS-2; code_DK: 644-1128-2-ND
U11 = IFX54211MB_V33: code_DK: NN; code_MO: 726-IFX54211MBV33HTM
U12 = XMC4200_VQFN48: code_DK: XMC4200Q48K256ABXUMA1CT-ND

## Nets that join several sheets
+VCC_DBGuP_ext: 2 - Sense2GoL_V1.2_Main_Board (5 pins), 3 - Sense2GoL_V1.2_Debugger (D7.2 R99.2)
GND: 2 - Sense2GoL_V1.2_Main_Board (35 pins), 3 - Sense2GoL_V1.2_Debugger (25 pins)
SWDCLK: 2 - Sense2GoL_V1.2_Main_Board (U2.14), 3 - Sense2GoL_V1.2_Debugger (R105.2)
SWDIO: 2 - Sense2GoL_V1.2_Main_Board (U2.13), 3 - Sense2GoL_V1.2_Debugger (R104.2)
UART-RX: 2 - Sense2GoL_V1.2_Main_Board (U2.15), 3 - Sense2GoL_V1.2_Debugger (U12.46)
UART-TX: 2 - Sense2GoL_V1.2_Main_Board (U2.16), 3 - Sense2GoL_V1.2_Debugger (R106.2)